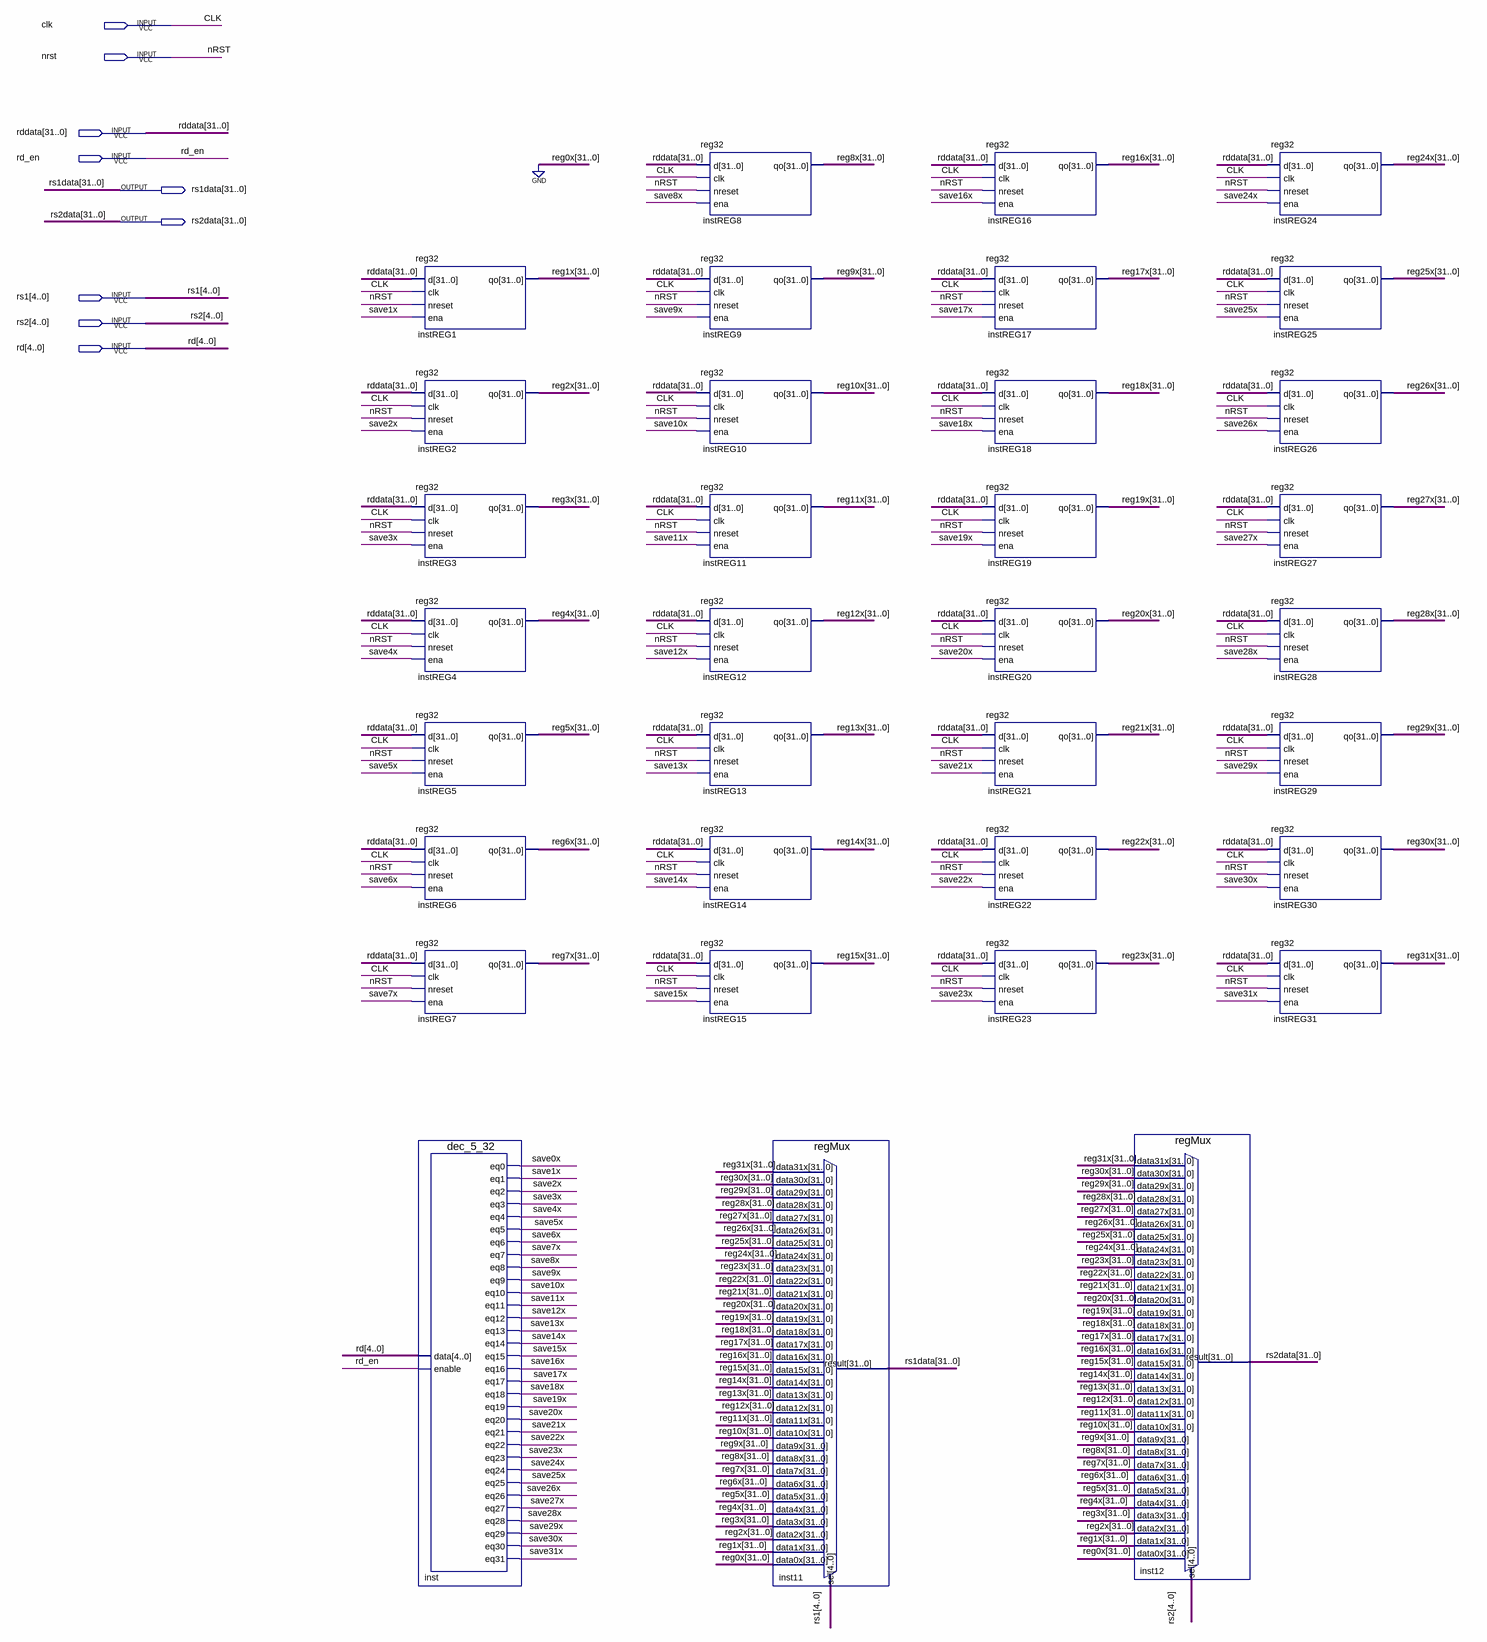
[diagram p0: schematic sheet]
// Quartus schematic regbank.bdf as structural Verilog: 34 symbols, 9 pins
module regbank (
  input  clk,
  input  nrst,
  input  [31:0] rddata,
  input  rd_en,
  input  [4:0] rs1,
  input  [4:0] rs2,
  input  [4:0] rd,
  output [31:0] rs1data,
  output [31:0] rs2data
);

  wire save0x, save1x, save2x, save3x, save4x, save5x, save6x, save7x, save8x, save9x, save10x, save11x,
       save12x, save13x, save14x, save15x, save16x, save17x, save18x, save19x, save20x, save21x, save22x,
       save23x, save24x, save25x, save26x, save27x, save28x, save29x, save30x, save31x;
  wire [31:0] reg1x, reg2x, reg3x, reg4x, reg5x, reg6x, reg7x, reg8x, reg9x, reg10x, reg11x, reg12x, reg13x,
       reg14x, reg15x, reg16x, reg17x, reg18x, reg19x, reg20x, reg21x, reg22x, reg23x, reg24x, reg25x,
       reg26x, reg27x, reg28x, reg29x, reg30x, reg31x;

  reg32 instREG1 (.d(rddata), .clk(clk), .nreset(nrst), .ena(save1x), .qo(reg1x));
  reg32 instREG2 (.d(rddata), .clk(clk), .nreset(nrst), .ena(save2x), .qo(reg2x));
  reg32 instREG3 (.d(rddata), .clk(clk), .nreset(nrst), .ena(save3x), .qo(reg3x));
  reg32 instREG4 (.d(rddata), .clk(clk), .nreset(nrst), .ena(save4x), .qo(reg4x));
  reg32 instREG5 (.d(rddata), .clk(clk), .nreset(nrst), .ena(save5x), .qo(reg5x));
  reg32 instREG6 (.d(rddata), .clk(clk), .nreset(nrst), .ena(save6x), .qo(reg6x));
  reg32 instREG7 (.d(rddata), .clk(clk), .nreset(nrst), .ena(save7x), .qo(reg7x));
  dec_5_32 inst (
    .data(rd), .enable(rd_en), .eq0(save0x), .eq1(save1x), .eq2(save2x), .eq3(save3x), .eq4(save4x),
    .eq5(save5x), .eq6(save6x), .eq7(save7x), .eq8(save8x), .eq9(save9x), .eq10(save10x), .eq11(save11x),
    .eq12(save12x), .eq13(save13x), .eq14(save14x), .eq15(save15x), .eq16(save16x), .eq17(save17x),
    .eq18(save18x), .eq19(save19x), .eq20(save20x), .eq21(save21x), .eq22(save22x), .eq23(save23x),
    .eq24(save24x), .eq25(save25x), .eq26(save26x), .eq27(save27x), .eq28(save28x), .eq29(save29x),
    .eq30(save30x), .eq31(save31x));
  reg32 instREG8 (.d(rddata), .clk(clk), .nreset(nrst), .ena(save8x), .qo(reg8x));
  reg32 instREG9 (.d(rddata), .clk(clk), .nreset(nrst), .ena(save9x), .qo(reg9x));
  reg32 instREG10 (.d(rddata), .clk(clk), .nreset(nrst), .ena(save10x), .qo(reg10x));
  reg32 instREG11 (.d(rddata), .clk(clk), .nreset(nrst), .ena(save11x), .qo(reg11x));
  reg32 instREG12 (.d(rddata), .clk(clk), .nreset(nrst), .ena(save12x), .qo(reg12x));
  reg32 instREG13 (.d(rddata), .clk(clk), .nreset(nrst), .ena(save13x), .qo(reg13x));
  reg32 instREG14 (.d(rddata), .clk(clk), .nreset(nrst), .ena(save14x), .qo(reg14x));
  reg32 instREG15 (.d(rddata), .clk(clk), .nreset(nrst), .ena(save15x), .qo(reg15x));
  regMux inst11 (
    .data31x(reg31x), .data30x(reg30x), .data29x(reg29x), .data28x(reg28x), .data27x(reg27x),
    .data26x(reg26x), .data25x(reg25x), .data24x(reg24x), .data23x(reg23x), .data22x(reg22x),
    .data21x(reg21x), .data20x(reg20x), .data19x(reg19x), .data18x(reg18x), .data17x(reg17x),
    .data16x(reg16x), .data15x(reg15x), .data14x(reg14x), .data13x(reg13x), .data12x(reg12x),
    .data11x(reg11x), .data10x(reg10x), .data9x(reg9x), .data8x(reg8x), .data7x(reg7x), .data6x(reg6x),
    .data5x(reg5x), .data4x(reg4x), .data3x(reg3x), .data2x(reg2x), .data1x(reg1x), .data0x({32{1'b0}}),
    .sel(rs1), .result(rs1data));
  reg32 instREG16 (.d(rddata), .clk(clk), .nreset(nrst), .ena(save16x), .qo(reg16x));
  reg32 instREG17 (.d(rddata), .clk(clk), .nreset(nrst), .ena(save17x), .qo(reg17x));
  reg32 instREG18 (.d(rddata), .clk(clk), .nreset(nrst), .ena(save18x), .qo(reg18x));
  reg32 instREG19 (.d(rddata), .clk(clk), .nreset(nrst), .ena(save19x), .qo(reg19x));
  reg32 instREG20 (.d(rddata), .clk(clk), .nreset(nrst), .ena(save20x), .qo(reg20x));
  reg32 instREG21 (.d(rddata), .clk(clk), .nreset(nrst), .ena(save21x), .qo(reg21x));
  reg32 instREG22 (.d(rddata), .clk(clk), .nreset(nrst), .ena(save22x), .qo(reg22x));
  reg32 instREG23 (.d(rddata), .clk(clk), .nreset(nrst), .ena(save23x), .qo(reg23x));
  regMux inst12 (
    .data31x(reg31x), .data30x(reg30x), .data29x(reg29x), .data28x(reg28x), .data27x(reg27x),
    .data26x(reg26x), .data25x(reg25x), .data24x(reg24x), .data23x(reg23x), .data22x(reg22x),
    .data21x(reg21x), .data20x(reg20x), .data19x(reg19x), .data18x(reg18x), .data17x(reg17x),
    .data16x(reg16x), .data15x(reg15x), .data14x(reg14x), .data13x(reg13x), .data12x(reg12x),
    .data11x(reg11x), .data10x(reg10x), .data9x(reg9x), .data8x(reg8x), .data7x(reg7x), .data6x(reg6x),
    .data5x(reg5x), .data4x(reg4x), .data3x(reg3x), .data2x(reg2x), .data1x(reg1x), .data0x({32{1'b0}}),
    .sel(rs2), .result(rs2data));
  reg32 instREG24 (.d(rddata), .clk(clk), .nreset(nrst), .ena(save24x), .qo(reg24x));
  reg32 instREG25 (.d(rddata), .clk(clk), .nreset(nrst), .ena(save25x), .qo(reg25x));
  reg32 instREG26 (.d(rddata), .clk(clk), .nreset(nrst), .ena(save26x), .qo(reg26x));
  reg32 instREG27 (.d(rddata), .clk(clk), .nreset(nrst), .ena(save27x), .qo(reg27x));
  reg32 instREG28 (.d(rddata), .clk(clk), .nreset(nrst), .ena(save28x), .qo(reg28x));
  reg32 instREG29 (.d(rddata), .clk(clk), .nreset(nrst), .ena(save29x), .qo(reg29x));
  reg32 instREG30 (.d(rddata), .clk(clk), .nreset(nrst), .ena(save30x), .qo(reg30x));
  reg32 instREG31 (.d(rddata), .clk(clk), .nreset(nrst), .ena(save31x), .qo(reg31x));
endmodule
